# Altium schematic sheet Microcontroller.SchDoc
size 400 x 350 mm; SheetNumber: 2; SheetTotal: 15
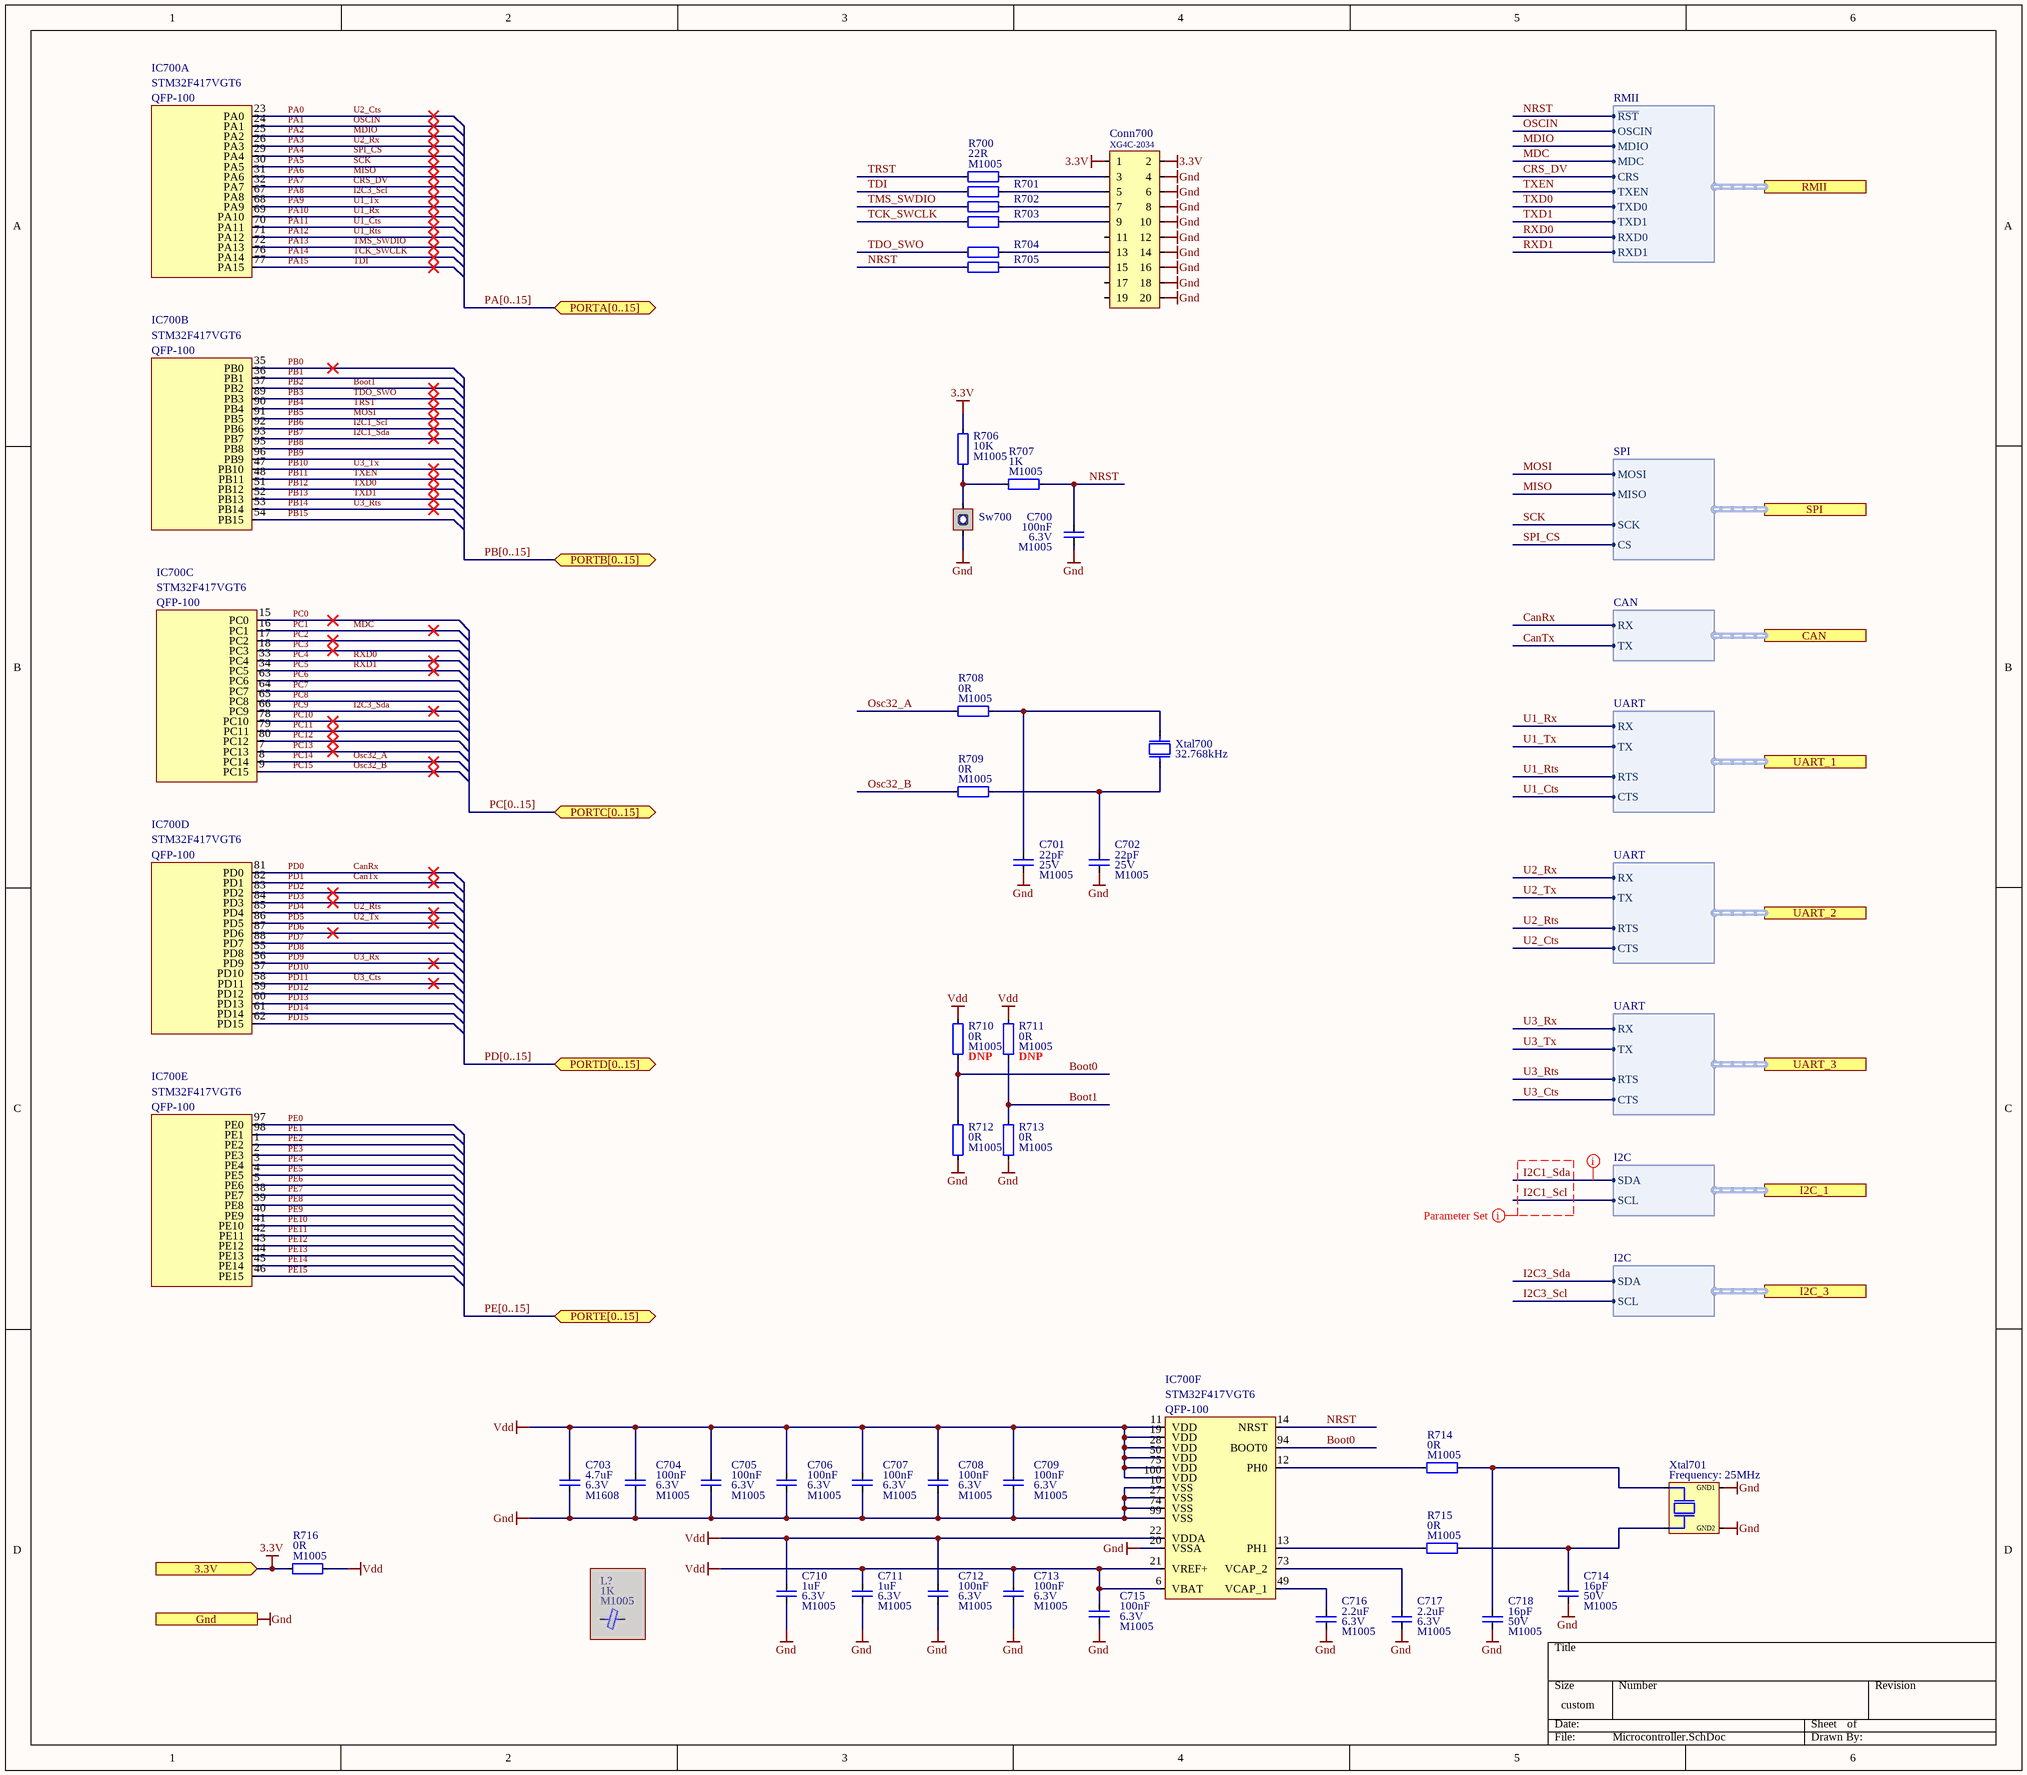
[diagram p0: Microcontroller.SchDoc]

## Parts
C700  value 100nF  Voltage: 6.3V  Package: M1005  [Capacitor_Ceramic_M1005_I0402]  (hidden comment: Capacitor_Ceramic)
C701  value 22pF  Voltage: 25V  Package: M1005  [Capacitor_Ceramic_M1005_I0402]  (hidden comment: Capacitor_Ceramic)
C702  value 22pF  Voltage: 25V  Package: M1005  [Capacitor_Ceramic_M1005_I0402]  (hidden comment: Capacitor_Ceramic)
C703  value 4.7uF  Voltage: 6.3V  Package: M1608  [Capacitor_Ceramic_M1608_I0603]  (hidden comment: Capacitor_Ceramic)
C704  value 100nF  Voltage: 6.3V  Package: M1005  [Capacitor_Ceramic_M1005_I0402]  (hidden comment: Capacitor_Ceramic)
C705  value 100nF  Voltage: 6.3V  Package: M1005  [Capacitor_Ceramic_M1005_I0402]  (hidden comment: Capacitor_Ceramic)
C706  value 100nF  Voltage: 6.3V  Package: M1005  [Capacitor_Ceramic_M1005_I0402]  (hidden comment: Capacitor_Ceramic)
C707  value 100nF  Voltage: 6.3V  Package: M1005  [Capacitor_Ceramic_M1005_I0402]  (hidden comment: Capacitor_Ceramic)
C708  value 100nF  Voltage: 6.3V  Package: M1005  [Capacitor_Ceramic_M1005_I0402]  (hidden comment: Capacitor_Ceramic)
C709  value 100nF  Voltage: 6.3V  Package: M1005  [Capacitor_Ceramic_M1005_I0402]  (hidden comment: Capacitor_Ceramic)
C710  value 1uF  Voltage: 6.3V  Package: M1005  [Capacitor_Ceramic_M1005_I0402]  (hidden comment: Capacitor_Ceramic)
C711  value 1uF  Voltage: 6.3V  Package: M1005  [Capacitor_Ceramic_M1005_I0402]  (hidden comment: Capacitor_Ceramic)
C712  value 100nF  Voltage: 6.3V  Package: M1005  [Capacitor_Ceramic_M1005_I0402]  (hidden comment: Capacitor_Ceramic)
C713  value 100nF  Voltage: 6.3V  Package: M1005  [Capacitor_Ceramic_M1005_I0402]  (hidden comment: Capacitor_Ceramic)
C714  value 16pF  Voltage: 50V  Package: M1005  [Capacitor_Ceramic_M1005_I0402]  (hidden comment: Capacitor_Ceramic)
C715  value 100nF  Voltage: 6.3V  Package: M1005  [Capacitor_Ceramic_M1005_I0402]  (hidden comment: Capacitor_Ceramic)
C716  value 2.2uF  Voltage: 6.3V  Package: M1005  [Capacitor_Ceramic_M1005_I0402]  (hidden comment: Capacitor_Ceramic)
C717  value 2.2uF  Voltage: 6.3V  Package: M1005  [Capacitor_Ceramic_M1005_I0402]  (hidden comment: Capacitor_Ceramic)
C718  value 16pF  Voltage: 50V  Package: M1005  [Capacitor_Ceramic_M1005_I0402]  (hidden comment: Capacitor_Ceramic)
Conn700  Manufacturer Part Number: XG4C-2034  [Connector - Omron, XG4C-2034]  (hidden comment: Connector - 20P)
IC700  Manufacturer Part Number: STM32F417VGT6  Package: QFP-100  [QFP-100, 14mm x 14mm, 0.5mm]  (hidden comment: STM, STM32F417VxTx)  (parts A,B,C,D,E,F of 6)
L?  value 1K  Package: M1005  [Ferrite_Bead_Smd_M1005_I0402]  (hidden comment: Ferrite Bead)  (masked out: inside a compile mask, not in the netlist)
R700  value 22R  Package: M1005  [Resistor_Smd_M1005_I0402]  (hidden comment: Resistor)
R701  Resistor  [Resistor_Smd_M1005_I0402]  (value not drawn)
R702  Resistor  [Resistor_Smd_M1005_I0402]  (value not drawn)
R703  Resistor  [Resistor_Smd_M1005_I0402]  (value not drawn)
R704  Resistor  [Resistor_Smd_M1005_I0402]  (value not drawn)
R705  Resistor  [Resistor_Smd_M1005_I0402]  (value not drawn)
R706  value 10K  Package: M1005  [Resistor_Smd_M1005_I0402]  (hidden comment: Resistor)
R707  value 1K  Package: M1005  [Resistor_Smd_M1005_I0402]  (hidden comment: Resistor)
R708  value 0R  Package: M1005  [Resistor_Smd_M1005_I0402]  (hidden comment: Resistor)
R709  value 0R  Package: M1005  [Resistor_Smd_M1005_I0402]  (hidden comment: Resistor)
R710  value 0R  Package: M1005  [Resistor_Smd_M1005_I0402]  (hidden comment: Resistor)
R711  value 0R  Package: M1005  [Resistor_Smd_M1005_I0402]  (hidden comment: Resistor)
R712  value 0R  Package: M1005  [Resistor_Smd_M1005_I0402]  (hidden comment: Resistor)
R713  value 0R  Package: M1005  [Resistor_Smd_M1005_I0402]  (hidden comment: Resistor)
R714  value 0R  Package: M1005  [Resistor_Smd_M1005_I0402]  (hidden comment: Resistor)
R715  value 0R  Package: M1005  [Resistor_Smd_M1005_I0402]  (hidden comment: Resistor)
R716  value 0R  Package: M1005  [Resistor_Smd_M1005_I0402]  (hidden comment: Resistor)
Sw700  Tactile, SPST  [Tactile, SPST - Panasonic, EVQQ2]  (value not drawn)
Xtal700  Frequency: 32.768kHz  [NDK, NX3215SA]  (hidden comment: Crystal)
Xtal701  Frequency: 25MHz  [Kyocera, CX3225SB]  (hidden comment: Crystal, Two Gnd Pins)

## Ports
3.3V (in), CAN (harness CAN), Gnd (in), I2C_1 (harness I2C), I2C_3 (harness I2C), PORTA[0..15] (bidir), PORTB[0..15] (bidir), PORTC[0..15] (bidir), PORTD[0..15] (bidir), PORTE[0..15] (bidir), RMII (harness RMII), SPI (harness SPI), UART_1 (harness UART), UART_2 (harness UART), UART_3 (harness UART)

## Harnesses
I2C: SDA, SCL
UART: RX, TX, RTS, CTS
CAN: RX, TX
SPI: MOSI, MISO, SCK, CS
RMII: ~{RST}, OSCIN, MDIO, CRS, MDC, TXEN, TXD0, TXD1, RXD0, RXD1

## Nets
3.3V: Conn700.1 Conn700.2 R706.1 R716.1 ; port 3.3V
Gnd: C700.2 C701.2 C702.2 C703.2 C704.2 C705.2 C706.2 C707.2 C708.2 C709.2 C710.2 C711.2 C712.2 C713.2 C714.2 C715.2 C716.2 C717.2 C718.2 Conn700.4 Conn700.6 Conn700.8 Conn700.10 Conn700.12 Conn700.14 Conn700.16 Conn700.18 Conn700.20 IC700.10(VSS) IC700.20(VSSA) IC700.27(VSS) IC700.74(VSS) IC700.99(VSS) R712.1 R713.1 Sw700.B Xtal701.GND1 Xtal701.GND2 ; port Gnd
Vdd: C703.1 C704.1 C705.1 C706.1 C707.1 C708.1 C709.1 C710.1 C711.1 C712.1 C713.1 C715.1 IC700.6(VBAT) IC700.11(VDD) IC700.19(VDD) IC700.21(VREF+) IC700.22(VDDA) IC700.28(VDD) IC700.50(VDD) IC700.75(VDD) IC700.100(VDD) R710.2 R711.2 R716.2
Boot0: IC700.94(BOOT0) R710.1 R712.2
Boot1: IC700.37(PB2) R711.1 R713.2  [also labelled PB2]
CanRx: IC700.81(PD0) ; port CAN.RX  [also labelled PD0]
CanTx: IC700.82(PD1) ; port CAN.TX  [also labelled PD1]
CRS_DV: IC700.32(PA7) ; port RMII.CRS  [also labelled PA7]
I2C1_Scl: IC700.92(PB6) ; port I2C_1.SCL  [also labelled PB6]
I2C1_Sda: IC700.93(PB7) ; port I2C_1.SDA  [also labelled PB7]
I2C3_Scl: IC700.67(PA8) ; port I2C_3.SCL  [also labelled PA8]
I2C3_Sda: IC700.66(PC9) ; port I2C_3.SDA  [also labelled PC9]
MDC: IC700.16(PC1) ; port RMII.MDC  [also labelled PC1]
MDIO: IC700.25(PA2) ; port RMII.MDIO  [also labelled PA2]
MISO: IC700.31(PA6) ; port SPI.MISO  [also labelled PA6]
MOSI: IC700.91(PB5) ; port SPI.MOSI  [also labelled PB5]
NRST: C700.1 IC700.14(NRST) R705.1 R707.2 ; port RMII.~{RST}
Osc32_A: IC700.8(PC14) R708.1  [also labelled PC14]
Osc32_B: IC700.9(PC15) R709.1  [also labelled PC15]
OSCIN: IC700.24(PA1) ; port RMII.OSCIN  [also labelled PA1]
PA0: IC700.23(PA0) ; port UART_2.CTS  [also labelled U2_Cts]
PA3: IC700.26(PA3) ; port UART_2.RX  [also labelled U2_Rx]
PA4: IC700.29(PA4) ; port SPI.CS  [also labelled SPI_CS]
PA5: IC700.30(PA5) ; port SPI.SCK  [also labelled SCK]
PA9: IC700.68(PA9) ; port UART_1.TX  [also labelled U1_Tx]
PA10: IC700.69(PA10) ; port UART_1.RX  [also labelled U1_Rx]
PA11: IC700.70(PA11) ; port UART_1.CTS  [also labelled U1_Cts]
PA12: IC700.71(PA12) ; port UART_1.RTS  [also labelled U1_Rts]
PA13: IC700.72(PA13) R702.1  [also labelled TMS_SWDIO]
PA14: IC700.76(PA14) R703.1  [also labelled TCK_SWCLK]
PA15: IC700.77(PA15) R701.1  [also labelled TDI]
PB0: IC700.35(PB0)
PB1: IC700.36(PB1)
PB3: IC700.89(PB3) R704.1  [also labelled TDO_SWO]
PB4: IC700.90(PB4) R700.1  [also labelled TRST]
PB8: IC700.95(PB8)
PB9: IC700.96(PB9)
PB10: IC700.47(PB10) ; port UART_3.TX  [also labelled U3_Tx]
PB11: IC700.48(PB11) ; port RMII.TXEN  [also labelled TXEN]
PB12: IC700.51(PB12) ; port RMII.TXD0  [also labelled TXD0]
PB13: IC700.52(PB13) ; port RMII.TXD1  [also labelled TXD1]
PB14: IC700.53(PB14) ; port UART_3.RTS  [also labelled U3_Rts]
PB15: IC700.54(PB15)
PC0: IC700.15(PC0)
PC2: IC700.17(PC2)
PC3: IC700.18(PC3)
PC4: IC700.33(PC4) ; port RMII.RXD0  [also labelled RXD0]
PC5: IC700.34(PC5) ; port RMII.RXD1  [also labelled RXD1]
PC6: IC700.63(PC6)
PC7: IC700.64(PC7)
PC8: IC700.65(PC8)
PC10: IC700.78(PC10)
PC11: IC700.79(PC11)
PC12: IC700.80(PC12)
PC13: IC700.7(PC13)
PD2: IC700.83(PD2)
PD3: IC700.84(PD3)
PD4: IC700.85(PD4) ; port UART_2.RTS  [also labelled U2_Rts]
PD5: IC700.86(PD5) ; port UART_2.TX  [also labelled U2_Tx]
PD6: IC700.87(PD6)
PD7: IC700.88(PD7)
PD8: IC700.55(PD8)
PD9: IC700.56(PD9) ; port UART_3.RX  [also labelled U3_Rx]
PD10: IC700.57(PD10)
PD11: IC700.58(PD11) ; port UART_3.CTS  [also labelled U3_Cts]
PD12: IC700.59(PD12)
PD13: IC700.60(PD13)
PD14: IC700.61(PD14)
PD15: IC700.62(PD15)
PE0: IC700.97(PE0)
PE1: IC700.98(PE1)
PE2: IC700.1(PE2)
PE3: IC700.2(PE3)
PE4: IC700.3(PE4)
PE5: IC700.4(PE5)
PE6: IC700.5(PE6)
PE7: IC700.38(PE7)
PE8: IC700.39(PE8)
PE9: IC700.40(PE9)
PE10: IC700.41(PE10)
PE11: IC700.42(PE11)
PE12: IC700.43(PE12)
PE13: IC700.44(PE13)
PE14: IC700.45(PE14)
PE15: IC700.46(PE15)
NetC701_1: C701.1 R708.2 Xtal700.2
NetC702_1: C702.1 R709.2 Xtal700.1
NetC714_1: C714.1 R715.2 Xtal701.1
NetC716_1: C716.1 IC700.49(VCAP_1)
NetC717_1: C717.1 IC700.73(VCAP_2)
NetC718_1: C718.1 R714.2 Xtal701.2
NetConn700_3: Conn700.3 R700.2
NetConn700_5: Conn700.5 R701.2
NetConn700_7: Conn700.7 R702.2
NetConn700_9: Conn700.9 R703.2
NetConn700_13: Conn700.13 R704.2
NetConn700_15: Conn700.15 R705.2
NetIC700_12: IC700.12(PH0) R714.1
NetIC700_13: IC700.13(PH1) R715.1
NetR706_2: R706.2 R707.1 Sw700.A

Not connected (* = marked no-connect by the designer): Conn700 11 17 19

## Buses and harness runs
bus PA[0..15] = port PORTA[0..15]
bus PB[0..15] = port PORTB[0..15]
bus PC[0..15] = port PORTC[0..15]
bus PD[0..15] = port PORTD[0..15]
bus PE[0..15] = port PORTE[0..15]

## Layout directives
net class I2C_LM: I2C1_Scl, I2C1_Sda

## Notes on the sheet
- (near R710) DNP
- (near R711) DNP

## Library data of the parts
C700 C704-C709 C712 C713 C715 = Capacitor_Ceramic: Cap, Cer, 100nF, 6.3V, M1005; Manufacturer Part Number: 04026D104KAT4A; Manufacturer: Kyocera; Temperature Coefficient: X5R; Tolerance: 10%; ComponentLink1Description: Datasheet; ComponentLink1URL: E:\Altium\Datasheets\Capacitor\Kyocera - X5R.pdf; ComponentLink2Description: Supplier Link; ComponentLink2URL: https://www.digikey.com/en/products/detail/kyocera-avx/04026D104KAT4A/8107673; Supplier: Digikey; Supplier Part Number: 478-11504-1-ND; Operating Temperature, Min: +85℃; Operating Temperature, Max: -55℃; Quantity, Min: 1; Quantity, Max: 250000; Price, Min: 0.1; Supplier Currency: $; Price, Max: 0.00189; Supplier Link: https://www.digikey.com/en/products/detail/kyocera-avx/04026D104KAT4A/8107673; Component Type: Ceramic; Component Category: Capacitor
C701 C702 = Capacitor_Ceramic: Cap, Cer, 22pF, 25V, M1005; Manufacturer Part Number: 0402N220J250CT; Manufacturer: Walsin; Temperature Coefficient: C0G, NP0; Tolerance: 5%; ComponentLink1Description: Datasheet; ComponentLink1URL: E:\Altium\Datasheets\Capacitor\Walsin - Multilayer Ceramic Capacitors.pdf; ComponentLink2Description: Supplier Link; ComponentLink2URL: https://www.digikey.com/en/products/detail/walsin-technology-corporation/0402N220J250CT/9354779; Supplier: Digikey; Supplier Part Number: 1292-1282-1-ND; Operating Temperature, Min: +125℃; Operating Temperature, Max: -55℃; Quantity, Min: 1; Quantity, Max: 250000; Price, Min: 0.1; Supplier Currency: $; Price, Max: 0.00177; Supplier Link: https://www.digikey.com/en/products/detail/walsin-technology-corporation/0402N220J250CT/9354779; Component Type: Ceramic; Component Category: Capacitor
C703 = Capacitor_Ceramic: Cap, Cer, 4.7uF, 6.3V, M1608; Manufacturer Part Number: CL10A475KQ8NNNC; Manufacturer: Samsung; Temperature Coefficient: X5R; Tolerance: 10%; ComponentLink1Description: Datasheet; ComponentLink1URL: E:\Altium\Datasheets\Capacitor\Samsung - Multi Layer Ceramic Capacitors.pdf; ComponentLink2Description: Supplier Link; ComponentLink2URL: https://www.digikey.com/en/products/detail/samsung-electro-mechanics/CL10A475KQ8NNNC/3886703; Supplier: Digikey; Supplier Part Number: 1276-1045-1-ND; Operating Temperature, Min: +85℃; Operating Temperature, Max: -55℃; Quantity, Min: 1; Quantity, Max: 400000; Price, Min: 0.1; Supplier Currency: $; Price, Max: 0.00444; Supplier Link: https://www.digikey.com/en/products/detail/samsung-electro-mechanics/CL10A475KQ8NNNC/3886703; Component Type: Ceramic; Component Category: Capacitor
C710 C711 = Capacitor_Ceramic: Cap, Cer, 1uF, 6.3V, M1005; Manufacturer Part Number: CL05A105MQ5NNNC; Manufacturer: Samsung; Temperature Coefficient: X5R; Tolerance: 20%; ComponentLink1Description: Datasheet; ComponentLink1URL: E:\Altium\Datasheets\Capacitor\Samsung - Multi Layer Ceramic Capacitors.pdf; ComponentLink2Description: Supplier Link; ComponentLink2URL: https://www.digikey.com/en/products/detail/samsung-electro-mechanics/CL05A105MQ5NNNC/3886893; Supplier: Digikey; Supplier Part Number: 1276-1235-1-ND; Operating Temperature, Min: +85℃; Operating Temperature, Max: -55℃; Quantity, Min: 1; Quantity, Max: 250000; Price, Min: 0.1; Supplier Currency: $; Price, Max: 0.00144; Supplier Link: https://www.digikey.com/en/products/detail/samsung-electro-mechanics/CL05A105MQ5NNNC/3886893; Component Type: Ceramic; Component Category: Capacitor
C714 C718 = Capacitor_Ceramic: Cap, Cer, 16pF, 50V, M1005; Manufacturer Part Number: 0402N160J500CT; Manufacturer: Walsin; Temperature Coefficient: C0G, NP0; Tolerance: 5%; ComponentLink1Description: Datasheet; ComponentLink1URL: E:\Altium\Datasheets\Capacitor\Walsin - Multilayer Ceramic Capacitors.pdf; ComponentLink2Description: Supplier Link; ComponentLink2URL: https://www.digikey.com/en/products/detail/walsin-technology-corporation/0402N160J500CT/9354759; Supplier: Digikey; Supplier Part Number: 1292-1262-1-ND; Operating Temperature, Min: +125℃; Operating Temperature, Max: -55℃; Quantity, Min: 1; Quantity, Max: 250000; Price, Min: 0.1; Supplier Currency: $; Price, Max: 0.00417; Supplier Link: https://www.digikey.com/en/products/detail/walsin-technology-corporation/0402N160J500CT/9354759; Component Type: Ceramic; Component Category: Capacitor
C716 C717 = Capacitor_Ceramic: Cap, Cer, 2.2uF, 6.3V, M1005; Manufacturer Part Number: CL05A225MQ5NNNC; Manufacturer: Samsung; Temperature Coefficient: X5R; Tolerance: 20%; ComponentLink1Description: Datasheet; ComponentLink1URL: E:\Altium\Datasheets\Capacitor\Samsung - Multi Layer Ceramic Capacitors.pdf; ComponentLink2Description: Supplier Link; ComponentLink2URL: https://www.digikey.com/en/products/detail/samsung-electro-mechanics/CL05A225MQ5NNNC/3887127; Supplier: Digikey; Supplier Part Number: 1276-1469-1-ND; Operating Temperature, Min: +85℃; Operating Temperature, Max: -55℃; Quantity, Min: 1; Quantity, Max: 250000; Price, Min: 0.1; Supplier Currency: $; Price, Max: 0.00244; Supplier Link: https://www.digikey.com/en/products/detail/samsung-electro-mechanics/CL05A225MQ5NNNC/3887127; Component Type: Ceramic; Component Category: Capacitor
Conn700 = Connector - 20P: Conn, Header, 20P, RA, TH, Shrouded; Manufacturer: Omron; ComponentLink1Description: Datasheet; ComponentLink1URL: E:\Altium\Datasheets\Connector - Header\Connector - Omron, XG4 Series.pdf; ComponentLink2Description: Supplier Link; ComponentLink2URL: https://www.digikey.com/en/products/detail/omron-electronics-inc-emc-div/XG4C-2034/1787182; Supplier: Digikey; Supplier Part Number: OR900-ND; Operating Temperature, Min: -55℃; Operating Temperature, Max: +105℃; Quantity, Min: 1; Quantity, Max: 450; Price, Min: 1.97; Supplier Currency: $; Price, Max: 1.27716; Supplier Link: https://www.digikey.com/en/products/detail/omron-electronics-inc-emc-div/XG4C-2034/1787182; Component Type: Header; Component Category: Connector; Package: TH, RA, Shrouded
IC700 = STM, STM32F417VxTx: IC, MCU, STM32F417, QFP-100; ComponentLink1Description: Datasheet; ComponentLink1URL: E:\Altium\Datasheets\IC - MCU\STM, STM32F415xx, STM32F417xx.pdf; ComponentLink2Description: Supplier Link; ComponentLink2URL: https://www.digikey.com/en/products/detail/stmicroelectronics/STM32F417VGT6/2757684; Supplier: Digikey; Supplier Part Number: 497-11900-ND; Manufacturer: STM; Operating Temperature, Min: -40℃; Operating Temperature, Max: +85℃; Quantity, Min: 1; Quantity, Max: 450; Price, Min: 19.05; Supplier Currency: $; Price, Max: 13.22667; Supplier Link: https://www.digikey.com/en/products/detail/stmicroelectronics/STM32F417VGT6/2757684; Component Type: MCU; Component Category: IC; ComponentLink3Description: Programming Manual; ComponentLink3URL: E:\Altium\Datasheets\IC - MCU\STM, STM32 Cortex -M4 MCUs and MPUs programming manual.pdf
L? = Ferrite Bead: Manufacturer Part Number: WLBD1005K2U102TP; Manufacturer: Walsin; Component Category: Inductor; ComponentLink1Description: Datasheet; ComponentLink1URL: E:\Altium\Datasheets\Inductor\Walsin, WLBD1005-WLBD4532 Chip Bead Series.pdf; ComponentLink2Description: Supplier Link; ComponentLink2URL: https://www.digikey.com/en/products/detail/walsin-technology-corporation/WLBD1005K2U102TP/14563847; Supplier: Digikey; Supplier Part Number: 1292-WLBD1005K2U102TPCT-ND; Operating Temperature, Min: -55℃; Operating Temperature, Max: +125℃; Quantity, Min: 1; Quantity, Max: 50000; Price, Min: 0.1; Price, Max: 0.0021; Supplier Currency: $; Supplier Link: https://www.digikey.com/en/products/detail/walsin-technology-corporation/WLBD1005K2U102TP/14563847; Component Type: Ferrite Bead
R700-R705 = Resistor: Res, 22R, 1%, M1005; Manufacturer: Yageo; Manufacturer Part Number: RC0402FR-0722RL; Component Category: Resistor; Component Type: Fixed Value; Tolerance: 1%; Supplier Link: https://www.digikey.com/en/products/detail/yageo/RC0402FR-0722RL/726562; Supplier Currency: $; Price, Max: 0.00129; Price, Min: 0.1; Quantity, Max: 100000; Quantity, Min: 1; Operating Temperature, Max: -55℃; Operating Temperature, Min: +155℃; Supplier Part Number: 311-22.0LRCT-ND; Supplier: Digikey; ComponentLink1Description: Datasheet; ComponentLink1URL: E:\Altium\Datasheets\Resistor\Yageo - RC_L Series.pdf; ComponentLink2Description: Supplier Link; ComponentLink2URL: https://www.digikey.com/en/products/detail/yageo/RC0402FR-0722RL/726562
  R701-R705: Value: 22R; Package: M1005
R706 = Resistor: Res, 10K, 1%, M1005; Manufacturer: Yageo; Manufacturer Part Number: RC0402FR-0710KP; Component Category: Resistor; Component Type: Fixed Value; Tolerance: 1%; Supplier Link: https://www.digikey.com/en/products/detail/yageo/RC0402FR-0710KP/4935264; Supplier Currency: $; Price, Max: 0.00282; Price, Min: 0.1; Quantity, Max: 100000; Quantity, Min: 1; Operating Temperature, Max: -55℃; Operating Temperature, Min: +155℃; Supplier Part Number: YAG1249CT-ND; Supplier: Digikey; ComponentLink1Description: Datasheet; ComponentLink1URL: E:\Altium\Datasheets\Resistor\Yageo - RC_L Series.pdf; ComponentLink2Description: Supplier Link; ComponentLink2URL: https://www.digikey.com/en/products/detail/yageo/RC0402FR-0710KP/4935264
R707 = Resistor: Res, 1K, 1%, M1005; Manufacturer: Yageo; Manufacturer Part Number: RC0402FR-071KP; Component Category: Resistor; Component Type: Fixed Value; Tolerance: 1%; Supplier Link: https://www.digikey.com/en/products/detail/yageo/RC0402FR-071KP/4935269; Supplier Currency: $; Price, Max: 0.00282; Price, Min: 0.1; Quantity, Max: 100000; Quantity, Min: 1; Operating Temperature, Max: -55℃; Operating Temperature, Min: +155℃; Supplier Part Number: YAG1254CT-ND; Supplier: Digikey; ComponentLink1Description: Datasheet; ComponentLink1URL: E:\Altium\Datasheets\Resistor\Yageo - RC_L Series.pdf; ComponentLink2Description: Supplier Link; ComponentLink2URL: https://www.digikey.com/en/products/detail/yageo/RC0402FR-071KP/4935269
R708-R716 = Resistor: Res, 0R, M1005; Manufacturer: Yageo; Manufacturer Part Number: RC0402FR-070RL; Component Category: Resistor; Component Type: Fixed Value; Tolerance: *; Supplier Link: https://www.digikey.com/en/products/detail/yageo/RC0402FR-070RL/2827570; Supplier Currency: $; Price, Max: 0.00109; Price, Min: 0.1; Quantity, Max: 50000; Quantity, Min: 1; Operating Temperature, Max: -55℃; Operating Temperature, Min: +155℃; Supplier Part Number: 311-0.0LRCT-ND; Supplier: Digikey; ComponentLink1Description: Datasheet; ComponentLink1URL: E:\Altium\Datasheets\Resistor\Yageo - RC_L Series.pdf; ComponentLink2Description: Supplier Link; ComponentLink2URL: https://www.digikey.com/en/products/detail/yageo/RC0402FR-070RL/2827570
Sw700 = Tactile, SPST: Switch, Tactile, SPST, SMD; Manufacturer: Panasonic; Manufacturer Part Number: EVQ-Q2K03W; ComponentLink1Description: Datasheet; ComponentLink1URL: E:\Altium\Datasheets\Switch\Tactile, SPST - Panasonic, EVQP0, EVQQ2, EVQ6Q2, EVQ7Q2, EVPBT Series.pdf; ComponentLink2Description: Supplier Link; ComponentLink2URL: https://www.digikey.com/en/products/detail/panasonic-electronic-components/EVQ-Q2K03W/762893; Supplier: Digikey; Supplier Part Number: P12943SCT-ND; Operating Temperature, Min: -40℃; Operating Temperature, Max: +85℃; Quantity, Min: 1; Quantity, Max: 10000; Price, Min: 0.32; Supplier Currency: $; Price, Max: 0.16174; Supplier Link: https://www.digikey.com/en/products/detail/panasonic-electronic-components/EVQ-Q2K03W/762893; Component Type: Tactile; Component Category: Switch; Package: SMD
Xtal700 = Crystal: XTAL, 32.768kHz, 12.5pF; Manufacturer: NDK; Manufacturer Part Number: NX3215SA-32.768K-STD-MUS-2; ComponentLink1Description: Datasheet; ComponentLink1URL: E:\Altium\Datasheets\Crystal\NDK, NX3215SA.pdf; ComponentLink2Description: Supplier Link; ComponentLink2URL: https://www.digikey.com/en/products/detail/ndk-america-inc/NX3215SA-32-768K-STD-MUS-2/2349033; Supplier: Digikey; Supplier Part Number: 644-1159-1-ND; Operating Temperature, Min: -40℃; Operating Temperature, Max: +125℃; Quantity, Min: 1; Quantity, Max: 15000; Price, Min: 0.74; Supplier Currency: $; Price, Max: 0.3432; Supplier Link: https://www.digikey.com/en/products/detail/ndk-america-inc/NX3215SA-32-768K-STD-MUS-2/2349033; Component Type: Crystal; Component Category: Crystal; Package: SMD
Xtal701 = Crystal, Two Gnd Pins: XTAL, 25MHz, 12pF; Manufacturer: Kyocera; Manufacturer Part Number: CX3225SB25000H0FLJCC; ComponentLink1Description: Datasheet; ComponentLink1URL: E:\Altium\Datasheets\Crystal\Kyocera, CX3225SB.pdf; ComponentLink2Description: Supplier Link; ComponentLink2URL: https://www.digikey.com/en/products/detail/kyocera-avx/cx3225sb25000h0fljcc/6123312; Supplier: Digikey; Supplier Part Number: 478-CX3225SB25000H0FLJCCCT-ND; Operating Temperature, Min: -30℃; Operating Temperature, Max: +85℃; Quantity, Min: 1; Quantity, Max: 15000; Price, Min: 0.66; Supplier Currency: $; Price, Max: 0.34087; Supplier Link: https://www.digikey.com/en/products/detail/kyocera-avx/cx3225sb25000h0fljcc/6123312; Component Type: Crystal; Component Category: Crystal; Package: SMD